# EAGLE design IOexpanderModule (EAGLE 9.6.2)
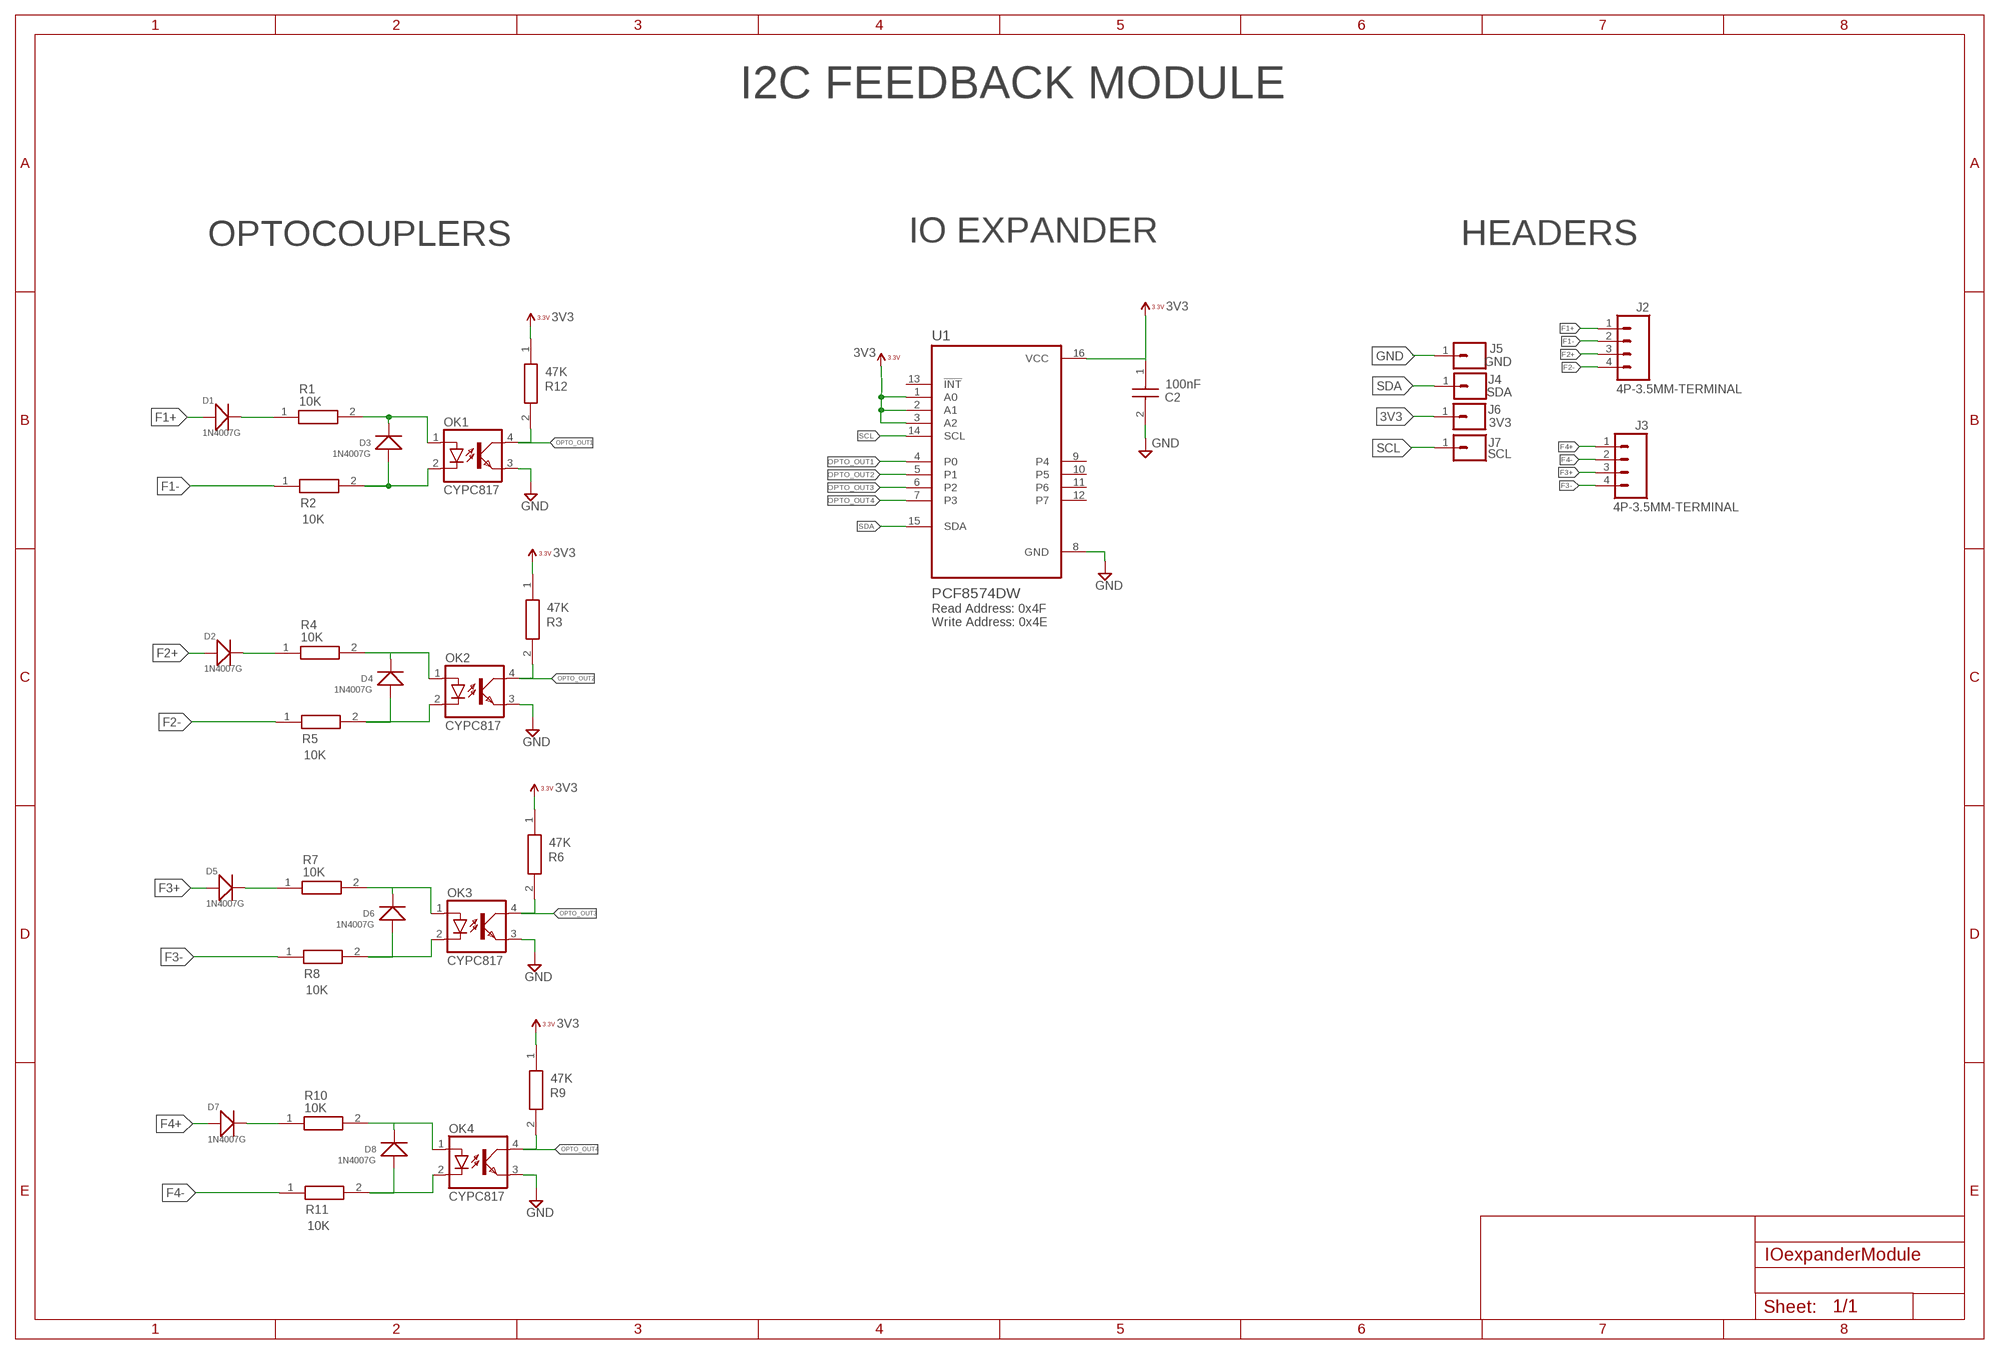
[diagram p0: schematic, sheet 1]

## Parts
C2  100nF  C0402C104K4RAC  [CAPC1005X55N]
D1  1N4007G  SMD-DIODE-SCHOTTKY-40V-1A(DO-214AC)  [DO-214AC]
D2  1N4007G  SMD-DIODE-SCHOTTKY-40V-1A(DO-214AC)  [DO-214AC]
D3  1N4007G  SMD-DIODE-SCHOTTKY-40V-1A(DO-214AC)  [DO-214AC]
D4  1N4007G  SMD-DIODE-SCHOTTKY-40V-1A(DO-214AC)  [DO-214AC]
D5  1N4007G  SMD-DIODE-SCHOTTKY-40V-1A(DO-214AC)  [DO-214AC]
D6  1N4007G  SMD-DIODE-SCHOTTKY-40V-1A(DO-214AC)  [DO-214AC]
D7  1N4007G  SMD-DIODE-SCHOTTKY-40V-1A(DO-214AC)  [DO-214AC]
D8  1N4007G  SMD-DIODE-SCHOTTKY-40V-1A(DO-214AC)  [DO-214AC]
J2  4P-3.5MM-TERMINAL  TERMINAL-PLUG-4P-3,5TERMINAL-3.5-4P  [HDRVR4W80P350_1X4_1540X690X920B]
J3  4P-3.5MM-TERMINAL  TERMINAL-PLUG-4P-3,5TERMINAL-3.5-4P  [HDRVR4W80P350_1X4_1540X690X920B]
J4  SDA  CONN_01_PAD  [1X01]
J5  GND  CONN_01_PAD  [1X01]
J6  3V3  CONN_01_PAD  [1X01]
J7  SCL  CONN_01_PAD  [1X01]
OK1  CYPC817  LTV816S  [DIL4-SMD]
OK2  CYPC817  LTV816S  [DIL4-SMD]
OK3  CYPC817  LTV816S  [DIL4-SMD]
OK4  CYPC817  LTV816S  [DIL4-SMD]
R1  10K  ERJ-P06J103V  [ERJP06D_1000V]
R2  10K  ERJ-P06J103V  [ERJP06D_1000V]
R3  47K  ERJ-2RKF4702X  [ERJ2RKD1004X]
R4  10K  ERJ-P06J103V  [ERJP06D_1000V]
R5  10K  ERJ-P06J103V  [ERJP06D_1000V]
R6  47K  ERJ-2RKF4702X  [ERJ2RKD1004X]
R7  10K  ERJ-P06J103V  [ERJP06D_1000V]
R8  10K  ERJ-P06J103V  [ERJP06D_1000V]
R9  47K  ERJ-2RKF4702X  [ERJ2RKD1004X]
R10  10K  ERJ-P06J103V  [ERJP06D_1000V]
R11  10K  ERJ-P06J103V  [ERJP06D_1000V]
R12  47K  ERJ-2RKF4702X  [ERJ2RKD1004X]
U1  PCF8574DW  [SOIC127P1030X265-16N]

## Nets
3V3: C2.1 J6.1 R3.1 R6.1 R9.1 R12.1 U1.1(A0) U1.2(A1) U1.3(A2) U1.16(VCC)
F1+: D1.1(+) J2.1
F1-: J2.2 R2.1
F2+: D2.1(+) J2.3
F2-: J2.4 R5.1
F3+: D5.1(+) J3.3
F3-: J3.4 R8.1
F4+: D7.1(+) J3.1
F4-: J3.2 R11.1
GND: C2.2 J5.1 OK1.3(EMIT) OK2.3(EMIT) OK3.3(EMIT) OK4.3(EMIT) U1.8(GND)
N$1: D4.2(-) OK2.1(A) R4.2
N$2: D3.2(-) OK1.1(A) R1.2
N$3: D4.1(+) OK2.2(C) R5.2
N$4: D2.2(-) R4.1
N$5: D1.2(-) R1.1
N$6: D6.2(-) OK3.1(A) R7.2
N$7: D6.1(+) OK3.2(C) R8.2
N$8: D5.2(-) R7.1
N$9: D8.2(-) OK4.1(A) R10.2
N$10: D8.1(+) OK4.2(C) R11.2
N$11: D7.2(-) R10.1
N$12: D3.1(+) OK1.2(C) R2.2
OPTO_OUT1: OK1.4(COL) R12.2 U1.4(P0)
OPTO_OUT2: OK2.4(COL) R3.2 U1.5(P1)
OPTO_OUT3: OK3.4(COL) R6.2 U1.6(P2)
OPTO_OUT4: OK4.4(COL) R9.2 U1.7(P3)
SCL: J7.1 U1.14(SCL)
SDA: J4.1 U1.15(SDA)
Unconnected: U1.9(P4) U1.10(P5) U1.11(P6) U1.12(P7) U1.13(!INT)

## Notes on the sheet
- I2C FEEDBACK MODULE
- OPTOCOUPLERS | IO EXPANDER | HEADERS
- Read Address: 0x4F
  Write Address: 0x4E

## Library data of the parts
C2 = C0402C104K4RAC:C0402C104K4RAC: Multilayer Ceramic Capacitors MLCC - SMD/SMT 16volts 0.1uF 10% X7R Source: Datasheet <https://content.kemet.com/datasheets/KEM_C1002_X7R_SMD.pdf>; PARTNUMBER: C0402C104K4RAC; PARTNUMBER2: C0402C104K8RAC; PARTNUMBER3: CC0402KRX7R8BB104
D1-D8 = Seeed-OPL-Diode:SMD-DIODE-SCHOTTKY-40V-1A(DO-214AC): 304020027; PARTNUMBER: S1M-13-F
J2 J3 = DielEnergia:TERMINAL-PLUG-4P-3,5: TERMINAL BLOCK, 3.5MM PITCH, 4 POLES, 180 DEGREES; PARTNUMBER: DB2EVC-3.5-4P-GN; PARTNUMBER2: KF2EDGV-3.5-4P; PARTNUMBER3: 395016004; PARTNUMBER4: 284514-4
J4 = DielEnergia:CONN_01_PAD; PARTNUMBER: YELLOW 24AWG WIRE 150MM
J5 = DielEnergia:CONN_01_PAD; PARTNUMBER: BLACK 24AWG WIRE 150MM
J6 = DielEnergia:CONN_01_PAD; PARTNUMBER: RED 24AWG WIRE 150MM
J7 = DielEnergia:CONN_01_PAD; PARTNUMBER: GREEN 24AWG WIRE 150MM
OK1-OK4 = optocoupler:LTV816: OPTO COUPLER Source: LITEON, LTV816.pdf; PARTNUMBER: CYPC817(C-TP2); PARTNUMBER2: TPC817S1C RAG
R1 R2 R4 R5 R7 R8 R10 R11 = ERJ-P06J103V:ERJ-P06J103V: Thick Film Resistors - SMD 0805 10Kohms 0.5W 5% AEC-Q200 Source: Datasheet <http://industrial.panasonic.com/cdbs/www-data/pdf/RDA0000/AOA0000C102.pdf>; PARTNUMBER: ERJ-P06J103V; PARTNUMBER2: SDR10EZPJ103; PARTNUMBER3: ERJ-P06F1002V
R3 R6 R9 R12 = ERJ-2RKF4702X:ERJ-2RKF4702X: Precision Thick Film Chip Resistor, 47Kohm, 0402, 1/10W; PARTNUMBER: ERJ-2RKF4702X; PARTNUMBER2: ERJ-2GEJ473X; PARTNUMBER3: RCS040247K0FKED
U1 = PCF8574DW:PCF8574DW: 8-bit 2.5- to 5.5-V I2C/SMBus I/O expander with interrupt; PARTNUMBER: PCF8574DWR

## Board
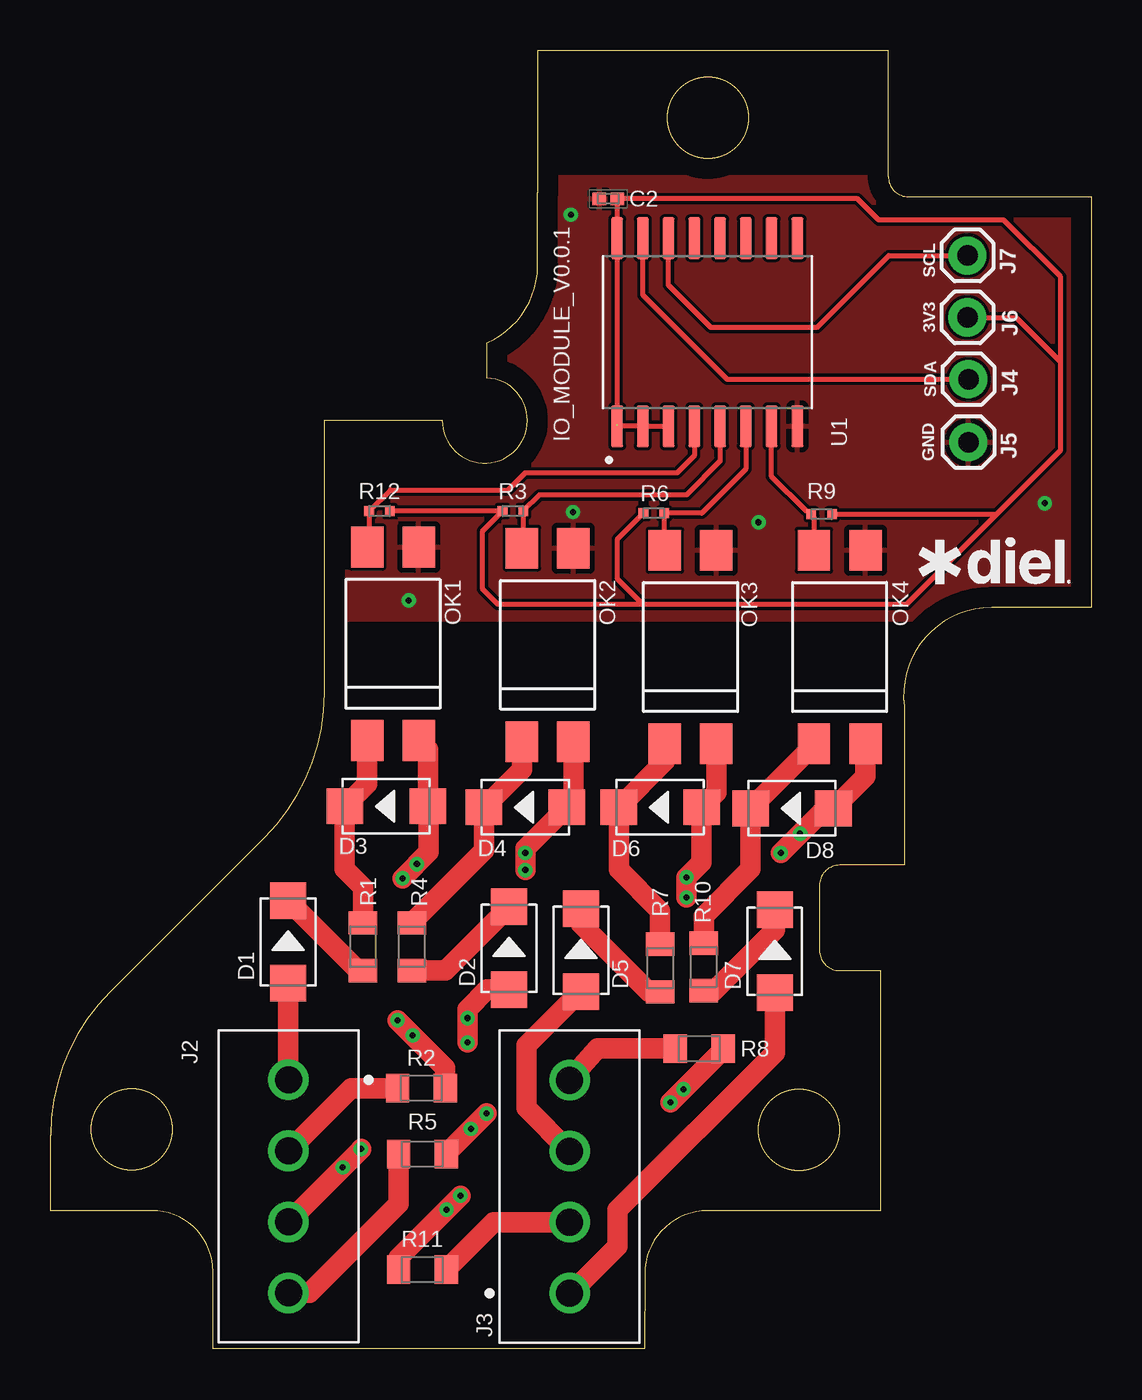
[diagram p1: board, top side]
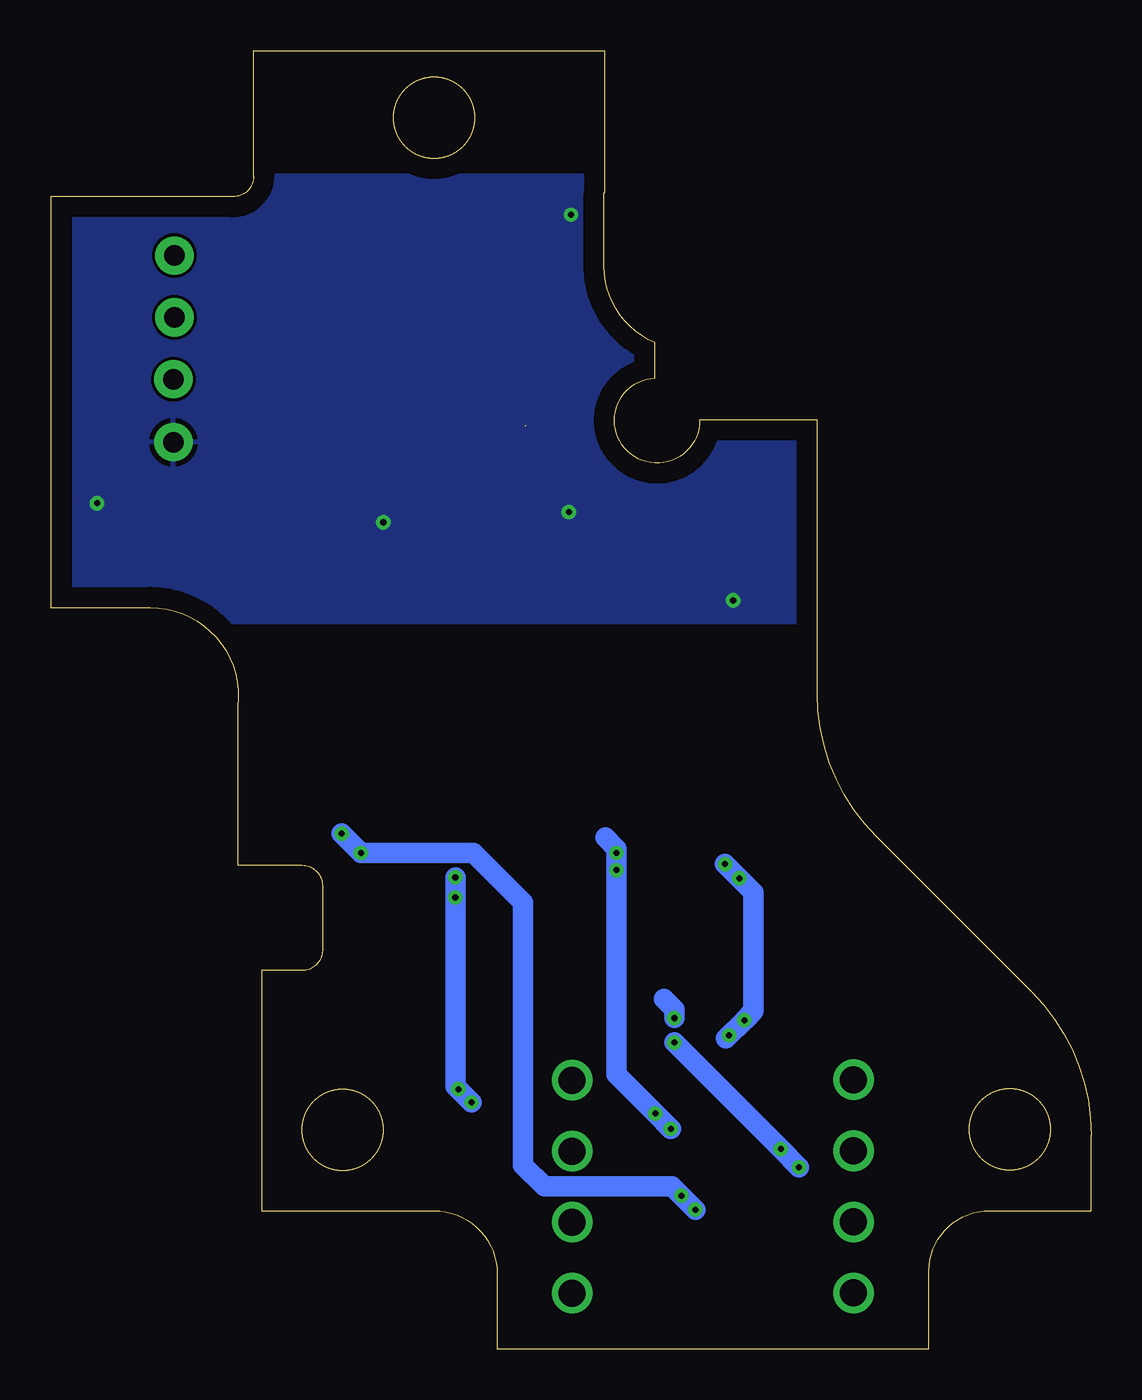
[diagram p2: board, bottom side, seen from below]

Size 51.3 x 64 mm. Coordinates in mm from the lower left corner, seen from the top.
Outline: 32.39,6.8 arc90 29.29,3.71
Outline: 8,3.81 arc90 5,6.81
Outline: 2.93,17.6 arc45 0,10.53
Outline: 10.57,25.24 arc45 13.5,32.31
Outline: 19.3,45.78 arc268 21.51,47.86
Outline: 21.51,49.61 arc67 24.01,53.38
Outline: 41.3,57.8 arc90 42.3,56.8
Outline: 46.4,36.55 arc97 42.08,31.67
Outline: 38.9,23.85 arc90 37.9,22.85
Outline: 37.9,19.65 arc90 38.9,18.65
Outline: 29.29,3.71 29.29,0 8,0 8,3.81
Outline: 5,6.81 0,6.81 0,10.53
Outline: 2.93,17.6 10.57,25.24
Outline: 13.5,32.31 13.5,45.78 19.3,45.78
Outline: 21.51,47.86 21.51,49.61
Outline: 24.01,53.38 24.01,57 24,57 24,64 41.3,64 41.3,57.8
Outline: 42.3,56.8 51.3,56.8 51.3,36.55 46.4,36.55
Outline: 42.08,31.67 42.08,23.85 38.9,23.85
Outline: 37.9,22.85 37.9,19.65
Outline: 38.9,18.65 40.9,18.65 40.9,6.8 32.39,6.8
Outline: 32.39,6.8 arc90 29.29,3.71
Outline: 8,3.81 arc90 5,6.81
Outline: 2.93,17.6 arc45 0,10.53
Outline: 10.57,25.24 arc45 13.5,32.31
Outline: 19.3,45.78 arc268 21.51,47.86
Outline: 21.51,49.61 arc67 24.01,53.38
Outline: 41.3,57.8 arc90 42.3,56.8
Outline: 46.4,36.55 arc97 42.08,31.67
Outline: 38.9,23.85 arc90 37.9,22.85
Outline: 37.9,19.65 arc90 38.9,18.65
Outline: circle at 36.9,10.8 radius 2
Outline: circle at 4,10.81 radius 2
Outline: circle at 36.9,10.8 radius 2
Outline: circle at 32.4,60.7 radius 2
Outline: circle at 4,10.81 radius 2
Copper layers (1*16): Top 0.035mm / dielectric 1.5mm / Bottom 0.035mm
Design rules "default *": minimum track width 6mil, minimum drill 0.3mm, track to track 6mil, track to pad 6mil, pad to pad 6mil, via to via 10mil, smd to smd 6mil, copper to edge 40mil, drill to drill 20mil, minimum pad ring 10mil, minimum via ring 8mil, stop-mask expansion 4mil, vias tented up to drill 0mil, thermal gap 10mil

### Footprints (pad centres in the part's own frame; a part is rotated, then mirrored left to right if it is on the bottom)
CAPC1005X55N = smd 0.65 x 0.62: 1 -0.44,0; 2 0.44,0
DO-214AC = smd 1.8 x 1.77: 1 -2.042,0; 2 2.042,0
HDRVR4W80P350_1X4_1540X690X920B = drill 1.331 pad 1.997: 1 0,0; 2 3.5,0; 3 7,0; 4 10.5,0
1X01 = drill 1.016 pad 1.88: 1 0,0
DIL4-SMD = smd 1.6 x 2: 1 -1.27,-4.77; 2 1.27,-4.77; 3 1.27,4.77; 4 -1.27,4.77
ERJP06D_1000V = smd 1.15 x 1.4: 1 -1.175,0; 2 1.175,0
ERJ2RKD1004X = smd 0.475 x 0.5: 1 -0.512,0; 2 0.512,0
SOIC127P1030X265-16N = smd 2.06 x 0.6: 1 -4.64,4.445; 2 -4.64,3.175; 3 -4.64,1.905; 4 -4.64,0.635; 5 -4.64,-0.635; 6 -4.64,-1.905; 7 -4.64,-3.175; 8 -4.64,-4.445; 9 4.64,-4.445; 10 4.64,-3.175; 11 4.64,-1.905; 12 4.64,-0.635; 13 4.64,0.635; 14 4.64,1.905; 15 4.64,3.175; 16 4.64,4.445

### Placement (x,y rotation side)
C2  27.49,56.7 180 top
D1  11.7,20.06 90 top
D2  22.6,19.75 90 top
D3  16.54,26.75 180 top
D4  23.4,26.7 180 top
D5  26.15,19.65 90 top
D6  30.05,26.7 180 top
D7  35.7,19.6 90 top
D8  36.55,26.65 180 top
J2  11.72,13.26 270 top
J3  25.59,2.74 90 top
J4  45.25,47.8 270 top
J5  45.25,44.7 270 top
J6  45.2,50.85 270 top
J7  45.2,53.9 270 top
OK1  16.88,34.76 0 top
OK2  24.5,34.7 0 top
OK3  31.55,34.6 0 top
OK4  38.9,34.6 0 top
R1  15.4,19.82 90 top
R2  18.27,12.85 0 top
R3  22.79,41.3 0 top
R4  17.8,19.82 90 top
R5  18.32,9.6 0 top
R6  29.74,41.2 0 top
R7  30.05,18.77 90 top
R8  31.98,14.8 0 top
R9  38.01,41.15 180 top
R10  32.2,18.82 90 top
R11  18.32,3.9 180 top
R12  16.21,41.3 180 top
U1  32.37,50.12 90 top

### Tracks (layer width: path | path; a pad name or v marks a point on that pad's centre or on a via)
3V3  (1 unrouted)
  Top 0.254: U1.3 30.43,45.52 30.39,45.48 U1.2 U1.1 27.89,45.52 | R9.1 46.65,41.15 | 46.65,41.15 49.8,44.3 49.8,48.65 | 29.2,36.7 42.2,36.7 46.65,41.15 | R12.1 R3.1 21.3,40.32 21.3,37.45 22.05,36.7 29.2,36.7 | 29.2,36.7 27.95,37.95 27.95,39.92 R6.1 | 27.93,45.55 U1.16 C2.1 39.78,56.7 40.83,55.66 46.99,55.66 49.8,52.85 49.8,48.65 | J6.1 47.6,50.85 49.8,48.65
F1+
  Top 1: D1.1 11.7,13.28 J2.1
F1-
  Top 1: R2.1 14.81,12.85 J2.2
F2+  (via drill 0.3)
  Top 1: D2.1 21.52,17.71 20.55,16.74 v20.55,16.3 v20.55,15.1 | J2.3 v15.3,9.84 v15.3,9.85
  Bottom 1: 21.07,17.25 20.55,16.73 v20.55,16.31 v20.55,16.3 | v20.55,15.1 v15.3,9.85 v14.4,8.95
F2-
  Top 1: J2.4 12.77,2.76 17.15,7.14 R5.1
F3+
  Top 1: D5.1 26.1,17.6 23.45,14.95 23.45,11.88 J3.3
F3-
  Top 1: R8.1 26.96,14.8 25.59,13.26 J3.4
F4+
  Top 1: D7.1 35.7,14.6 27.95,6.85 27.95,5.05 25.64,2.74 J3.1
F4-
  Top 1: R11.1 21.84,6.24 J3.2
GND  (via drill 0.3)
  other vias: 25.65,55.91 25.75,41.25 34.9,40.75 17.65,36.9 49.01,41.69
  pour Top: 23.63,57.77 48.93,57.77 50.6,56.1 50.6,36.4 50.15,35.95 14.05,35.95 14.05,48.19
  pour Bottom: 23.63,57.82 48.93,57.82 50.6,56.15 50.6,36.45 50,35.85 14.05,35.85 14.05,48.24
N$1
  Top 1: OK2.1 23.23,28.57 D4.2 21.36,24.56 R4.2
N$2
  Top 1: OK1.1 15.61,27.86 D3.2 14.5,23.65 15.4,22.75 R1.2
N$3  (via drill 0.3)
  Top 1: OK2.2 25.77,27.03 D4.1 23.4,24.66 v23.4,24.45 v23.4,23.6 | R5.2 v21.49,11.6
  Bottom 1: v21.49,11.6 20.74,10.85 v20.72,10.85 23.4,13.52 v23.4,23.6 23.4,24.65 23.95,25.2
N$4
  Top 1: R4.1 19.46,18.65 D2.2
N$5
  Top 1: R1.1 15.15,18.65 D1.2
N$6
  Top 1: OK3.1 30.28,28.97 D6.2 28.01,23.64 30.05,21.6 R7.2
N$7  (via drill 0.3)
  Top 1: OK3.2 32.82,27.43 D6.1 32.09,23.99 v31.35,23.25 v31.35,22.25 | v30.55,12.15 33.15,14.75 R8.2
  Bottom 1: v31.35,23.25 31.35,12.95 v31.2,12.8 v30.55,12.15
N$8
  Top 1: R7.1 29.49,17.6 26.15,20.94 D5.2
N$9
  Top 1: OK4.1 37.63,29.77 D8.2 34.51,23.66 32.2,21.35 R10.2
N$10  (via drill 0.3)
  Top 1: D8.1 40.17,28.23 OK4.2 | D8.1 | v20.2,7.55 v20.2,7.54 v19.52,6.86 17.15,4.49 R11.2 | D8.1 38.2,26.65 v36,24.45
  Bottom 1: v19.52,6.86 20.66,8 26.95,8 28,9.05 28,22 30.45,24.45 v36,24.45 v36.95,25.4
N$11
  Top 1: R10.1 32.71,17.65 35.7,20.64 D7.2
N$12  (via drill 0.3)
  Top 1: OK1.2 18.6,29.54 18.6,26.77 D3.1 18.63,26.7 18.63,24.48 v17.35,23.2 | R2.2 19.45,13.85 v17.85,15.45 v17.1,16.2
  Bottom 1: v18.05,23.9 v17.35,23.2 16.65,22.5 16.65,16.65 v17.1,16.2 18,15.3
OPTO_OUT1
  Top 0.254: OK1.4 15.7,39.62 R12.2 16.75,42.35 22.55,42.35 23.38,43.18 30.89,43.18 31.73,44.03 U1.4
OPTO_OUT2
  Top 0.254: OK2.4 23.3,39.54 R3.2 24.1,42.1 31.35,42.1 33.01,43.76 U1.5
OPTO_OUT3
  Top 0.254: OK3.4 30.25,39.4 R6.2 32.1,41.2 34.27,43.38 U1.6
OPTO_OUT4
  Top 0.254: OK4.4 37.63,41.02 R9.2 37.23,41.32 35.55,43.01 U1.7
SCL
  Top 0.254: U1.14 30.45,54.74 30.45,52.45 32.55,50.35 37.77,50.35 41.32,53.9 J7.1
SDA
  Top 0.254: U1.15 29.2,51.95 33.35,47.8 J4.1

### Text on the board
tNames: IO_MODULE_V0.0.1